# Altium schematic sheet PAGE8 - POWER DECAP AND.SchDoc
size 386 x 246 mm
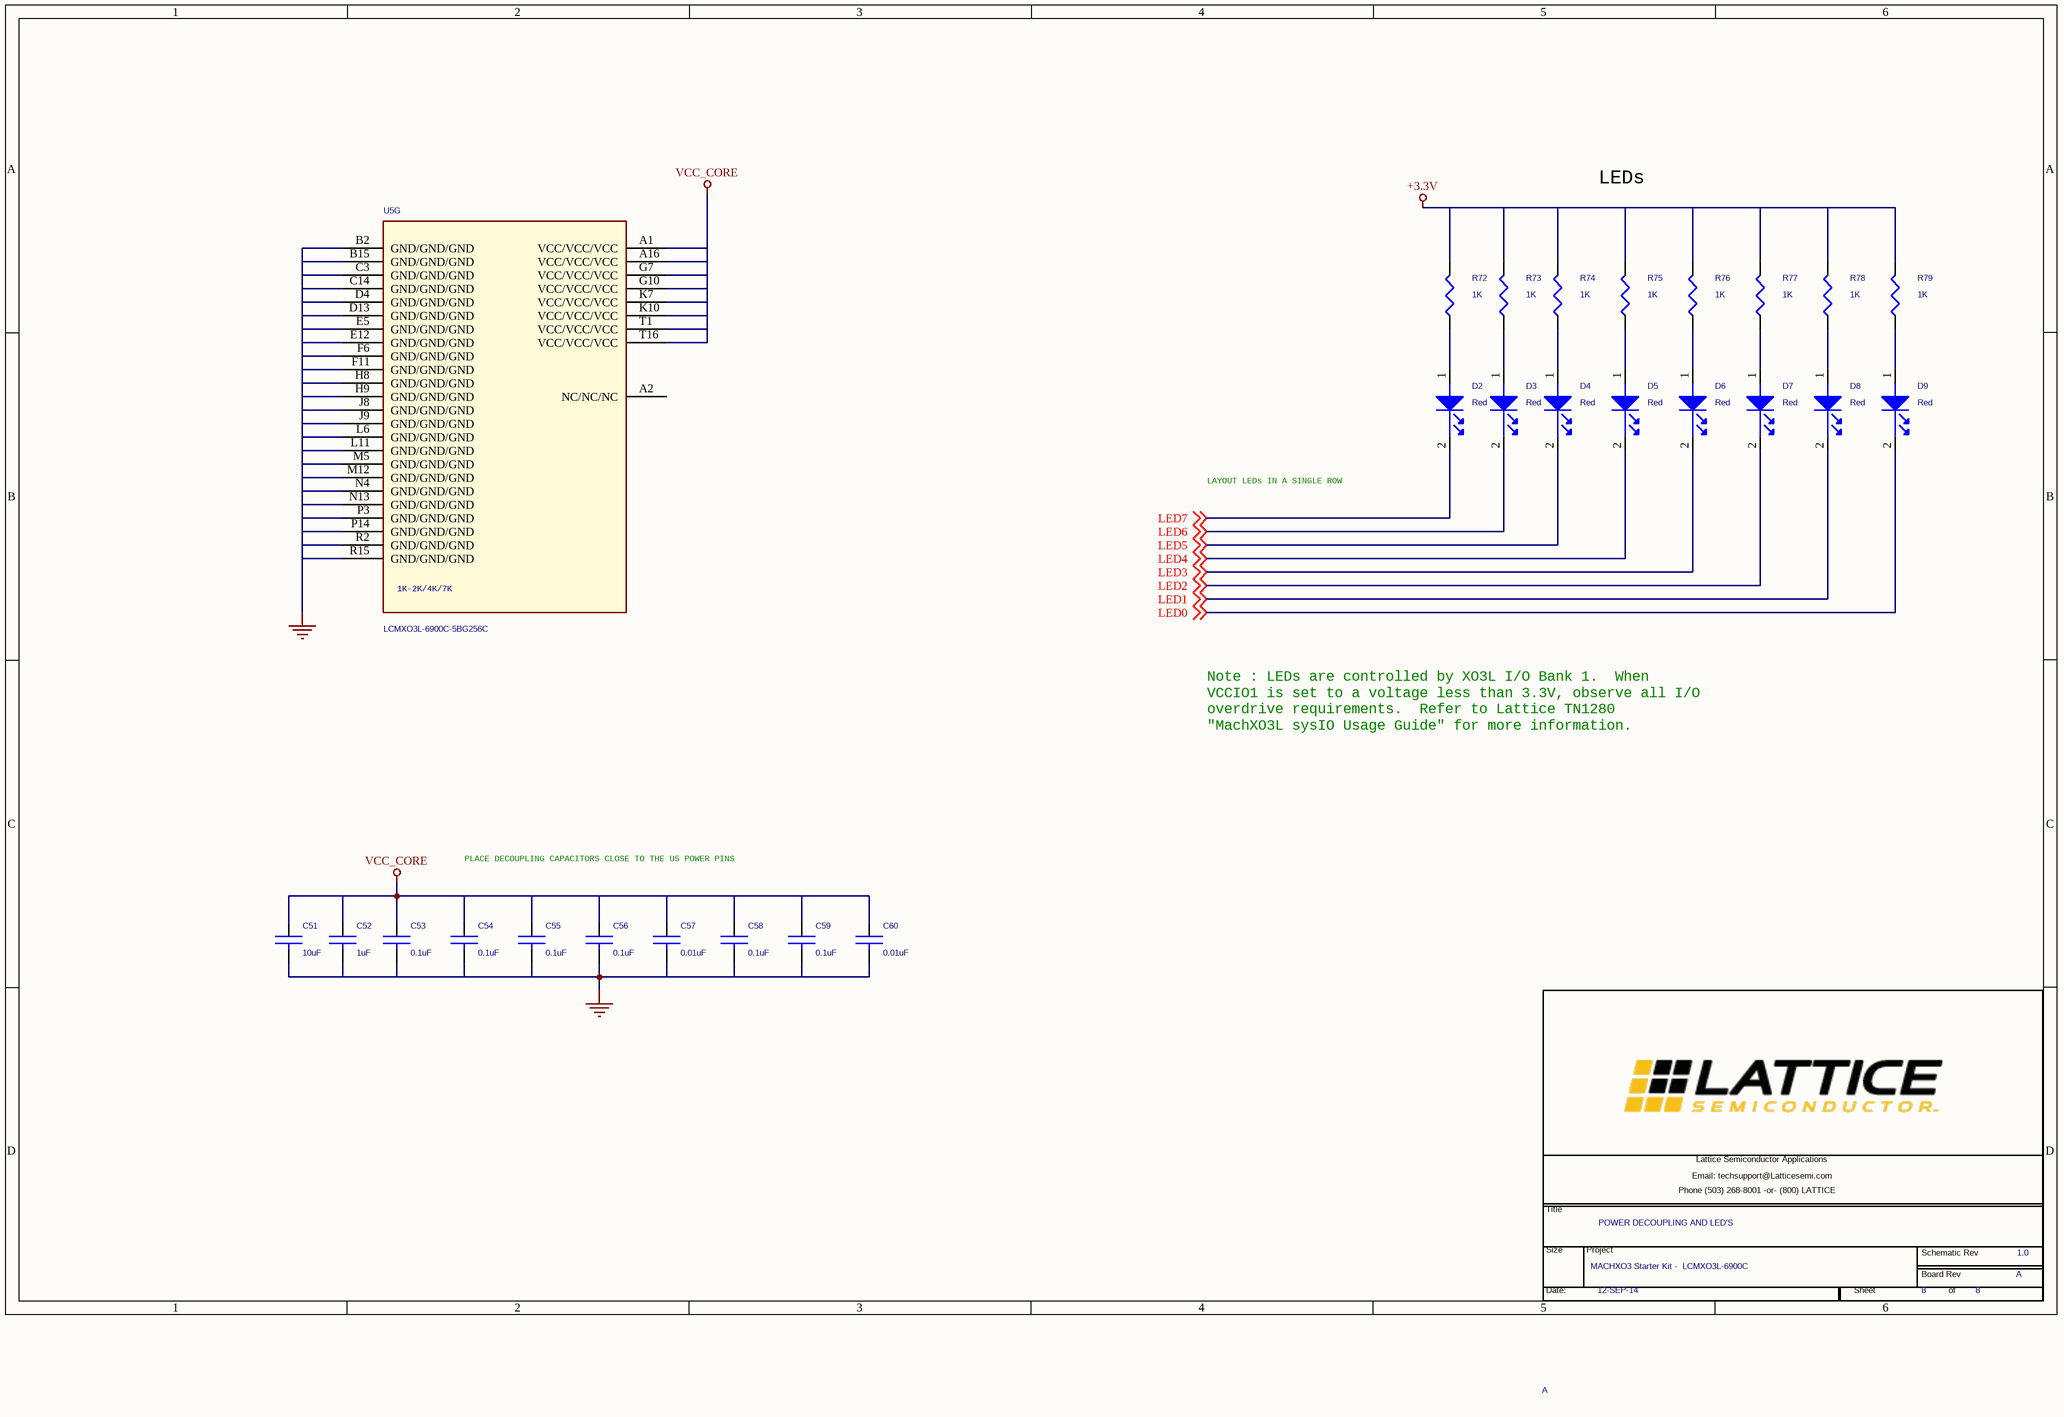
[diagram p0: PAGE8 - POWER DECAP AND.SchDoc]

## Parts
*  Project Name: MACHXO3 Starter Kit -  LCMXO3L-6900C  Title: POWER DECOUPLING AND LED'S  Page Number: 8  RevCode: 1.0  Page Size: A  Date:: 12-SEP-14  (hidden comment: Lattice Title Block New Brand)  (graphical)
C51  10uF  [cc0603]
C52  1uF  [cc0402]
C53  0.1uF  [cc0402]
C54  0.1uF  [cc0402]
C55  0.1uF  [cc0402]
C56  0.1uF  [cc0402]
C57  0.01uF  [cc0402]
C58  0.1uF  [cc0402]
C59  0.1uF  [cc0402]
C60  0.01uF  [cc0402]
D2  Red  [led_0603]
D3  Red  [led_0603]
D4  Red  [led_0603]
D5  Red  [led_0603]
D6  Red  [led_0603]
D7  Red  [led_0603]
D8  Red  [led_0603]
D9  Red  [led_0603]
R72  1K  [cr0402]
R73  1K  [cr0402]
R74  1K  [cr0402]
R75  1K  [cr0402]
R76  1K  [cr0402]
R77  1K  [cr0402]
R78  1K  [cr0402]
R79  1K  [cr0402]
U5  LCMXO3L-6900C-5BG256C  [bga256_0p8_14p0]  (part G of 7)

## Nets
+3.3V: R72.2 R73.2 R74.2 R75.2 R76.2 R77.2 R78.2 R79.2
GND: C51.2 C52.2 C53.2 C54.2 C55.2 C56.2 C57.2 C58.2 C59.2 C60.2 U5.B2(GND/GND/GND) U5.B15(GND/GND/GND) U5.C3(GND/GND/GND) U5.C14(GND/GND/GND) U5.D4(GND/GND/GND) U5.D13(GND/GND/GND) U5.E5(GND/GND/GND) U5.E12(GND/GND/GND) U5.F6(GND/GND/GND) U5.F11(GND/GND/GND) U5.H8(GND/GND/GND) U5.H9(GND/GND/GND) U5.J8(GND/GND/GND) U5.J9(GND/GND/GND) U5.L6(GND/GND/GND) U5.L11(GND/GND/GND) U5.M5(GND/GND/GND) U5.M12(GND/GND/GND) U5.N4(GND/GND/GND) U5.N13(GND/GND/GND) U5.P3(GND/GND/GND) U5.P14(GND/GND/GND) U5.R2(GND/GND/GND) U5.R15(GND/GND/GND)
VCC_CORE: C51.1 C52.1 C53.1 C54.1 C55.1 C56.1 C57.1 C58.1 C59.1 C60.1 U5.A1(VCC/VCC/VCC) U5.A16(VCC/VCC/VCC) U5.G7(VCC/VCC/VCC) U5.G10(VCC/VCC/VCC) U5.K7(VCC/VCC/VCC) U5.K10(VCC/VCC/VCC) U5.T1(VCC/VCC/VCC) U5.T16(VCC/VCC/VCC)
LED0: D9.2(CATHODE) ; off-sheet LED0
LED1: D8.2(CATHODE) ; off-sheet LED1
LED2: D7.2(CATHODE) ; off-sheet LED2
LED3: D6.2(CATHODE) ; off-sheet LED3
LED4: D5.2(CATHODE) ; off-sheet LED4
LED5: D4.2(CATHODE) ; off-sheet LED5
LED6: D3.2(CATHODE) ; off-sheet LED6
LED7: D2.2(CATHODE) ; off-sheet LED7
NetD2_1: D2.1(ANODE) R72.1
NetD3_1: D3.1(ANODE) R73.1
NetD4_1: D4.1(ANODE) R74.1
NetD5_1: D5.1(ANODE) R75.1
NetD6_1: D6.1(ANODE) R76.1
NetD7_1: D7.1(ANODE) R77.1
NetD8_1: D8.1(ANODE) R78.1
NetD9_1: D9.1(ANODE) R79.1

Not connected (* = marked no-connect by the designer): U5 A2(NC/NC/NC)

## Notes on the sheet
- LEDs
- LAYOUT LEDs IN A SINGLE ROW
- Note : LEDs are controlled by XO3L I/O Bank 1.  When
  VCCIO1 is set to a voltage less than 3.3V, observe all I/O
  overdrive requirements.  Refer to Lattice TN1280
  "MachXO3L sysIO Usage Guide" for more information.
- PLACE DECOUPLING CAPACITORS CLOSE TO THE U5 POWER PINS
- (in symbol Lattice Title Block New Brand) Lattice Semiconductor Applications; Email: techsupport@Latticesemi.com; Phone (503) 268-8001 -or- (800) LATTICE; Title; Size; Project; Schematic Rev; Board Rev; Date:; Sheet; of
- (in symbol LCMXO3L-1K/2K/4K/7K-BG256, part G) 1K-2K/4K/7K

## Library data of the parts
C51 = 10uF_0603: CAP CER 10UF 10V 20% X5R 0603; Manufacturer Part Number: LMK107BJ106MALTD; Manufacturer: Taiyo Yuden; Class: Discrete; Digikey P/N: 587-2562-1-ND
C52 = 1uF_0402: CAP CER 1UF 6.3V 10% X5R 0402; Manufacturer Part Number: C0402C105K9PACTU; Manufacturer: Kemet; Class: Discrete; Digikey P/N: 399-4873-1-ND
C53-C56 C58 C59 = 0u1_0402: CAP CER 0.1UF 16V 10% X7R 0402; Manufacturer Part Number: C0402C104K4RACTU; Manufacturer: Kemet; Class: Discrete; Digikey P/N: 399-3521-2-ND
C57 C60 = 0_01uF_0402: CAP CER 10000PF 16V 5% X7R 0402; Manufacturer Part Number: C0402C103J4RACTU; Manufacturer: Kemet; Class: Discrete; Digikey P/N: 399-1039-1-ND
D2-D9 = LED_0603_Red: LED SUPER RED CLEAR 0603 SMD; Manufacturer Part Number: LTST-C190KRKT; Manufacturer: LITE-On INC; Class: Discrete; Digikey P/N: 160-1436-2-ND
R72-R79 = 1k_0402: RES 1K OHM 1/10W 1% 0603 SMD; Manufacturer: Yageo; Manufacturer Part Number: RC0603FR-071KL; Class: Discrete; Digikey P/N: 311-1.00KHRCT-ND
U5 = LCMXO3L-1K/2K/4K/7K-BG256: IC FPGA 6864LUTS 256BGA; Manufacturer: Lattice semi; SPLIT_INST: TRUE; SWAP_INFO: (S1+S2+S3+S4+S5+S6+S7); Graphic: LCMXO3L-1K/2K/4K/7K-BG256A.Normal; Power Pins Visible: False; Source Library: D:\DESIGN_DOC\XO3\LATTICEORCADCAPTURESCHEMATICLIBRARYOLB\LATTICEORCADCAPTURESCHEMATICLIBRARYOLB\LATTICE_SYM\LATTICEPLDS.OLB; Location Y-Coordinate: 0; Implementation Type: <none>; Primitive: DEFAULT; Name: I16790692; Digikey P/N: 220-1886-ND; Manufacturer Part Number: LCMXO3L-6900C-5BG256C; Source Package: LCMXO3L-1K/2K/4K/7K-BG256; Source Part: LCMXO3L-1K/2K/4K/7K-BG256A.Normal; Color: Default; Location X-Coordinate: 0
* = Lattice Title Block New Brand: Page Count: 8; Board Rev: A